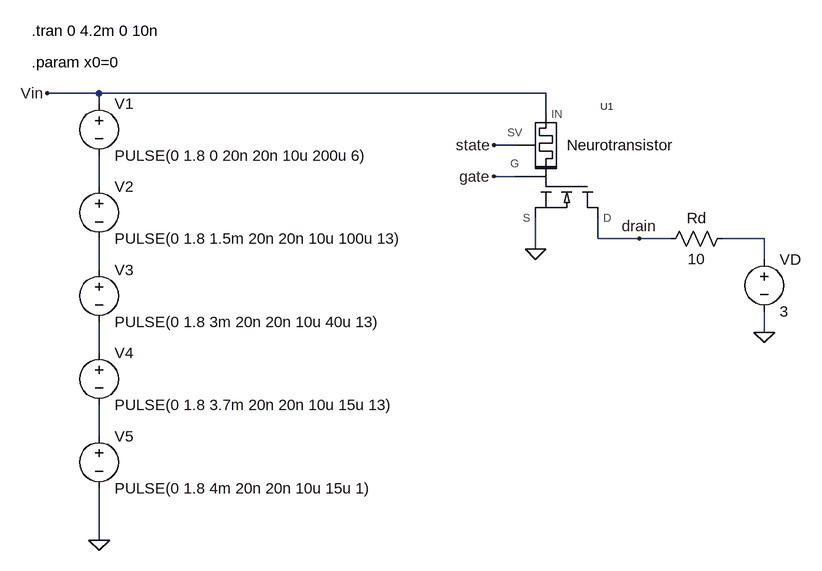
[diagram p0: schematic pulse_input.asc]
pulse_input.asc, the LTspice schematic file:
Version 4
SHEET 1 1728 2052
WIRE -80 256 -160 256
WIRE 608 256 -80 256
WIRE -80 272 -80 256
WIRE 608 288 608 256
WIRE 560 336 528 336
WIRE 560 384 528 384
WIRE -80 400 -80 352
WIRE 688 480 688 448
WIRE 752 480 688 480
WIRE 800 480 752 480
WIRE 944 480 880 480
WIRE 592 496 592 448
WIRE 944 512 944 480
WIRE -80 528 -80 480
WIRE 944 624 944 592
WIRE -80 656 -80 608
WIRE -80 784 -80 736
WIRE -80 944 -80 864
FLAG 528 336 state
FLAG 528 384 gate
FLAG -160 256 Vin
FLAG 592 496 0
FLAG 944 624 0
FLAG -80 944 0
FLAG 752 480 drain
SYMBOL res 896 464 R90
WINDOW 0 0 56 VBottom 2
WINDOW 3 32 56 VTop 2
SYMATTR InstName Rd
SYMATTR Value 10
SYMBOL voltage 944 496 R0
WINDOW 123 0 0 Left 0
WINDOW 39 0 0 Left 0
SYMATTR InstName VD
SYMATTR Value 3
SYMBOL voltage -80 256 R0
WINDOW 123 0 0 Left 0
WINDOW 39 0 0 Left 0
SYMATTR InstName V1
SYMATTR Value PULSE(0 1.8 0 20n 20n 10u 200u 6)
SYMBOL voltage -80 384 R0
WINDOW 123 0 0 Left 0
WINDOW 39 0 0 Left 0
SYMATTR InstName V2
SYMATTR Value PULSE(0 1.8 1.5m 20n 20n 10u 100u 13)
SYMBOL voltage -80 512 R0
WINDOW 123 0 0 Left 0
WINDOW 39 0 0 Left 0
SYMATTR InstName V3
SYMATTR Value PULSE(0 1.8 3m 20n 20n 10u 40u 13)
SYMBOL voltage -80 640 R0
WINDOW 123 0 0 Left 0
WINDOW 39 0 0 Left 0
SYMATTR InstName V4
SYMATTR Value PULSE(0 1.8 3.7m 20n 20n 10u 15u 13)
SYMBOL voltage -80 768 R0
WINDOW 123 0 0 Left 0
WINDOW 39 0 0 Left 0
SYMATTR InstName V5
SYMATTR Value PULSE(0 1.8 4m 20n 20n 10u 15u 1)
SYMBOL AutoGenerated\\Neurotransistor 592 288 R0
SYMATTR InstName U1
TEXT -184 160 Left 2 !.tran 0 4.2m 0 10n
TEXT -184 208 Left 2 !.param x0=0

The netlist it stands for:
* pulse_input.asc
Rd N002 drain 10
VD N002 0 3
V1 Vin N001 PULSE(0 1.8 0 20n 20n 10u 200u 6)
V2 N001 N003 PULSE(0 1.8 1.5m 20n 20n 10u 100u 13)
V3 N003 N004 PULSE(0 1.8 3m 20n 20n 10u 40u 13)
V4 N004 N005 PULSE(0 1.8 3.7m 20n 20n 10u 15u 13)
V5 N005 0 PULSE(0 1.8 4m 20n 20n 10u 15u 1)
XU1 Vin drain 0 gate state neurotransistor Neurotransistor  ; pins IN D S G SV
.tran 0 4.2m 0 10n
.param x0=0
.lib neurotransistor.sub
.backanno
.end